# EAGLE design ULN2003_DoubleStrip_v01 (EAGLE 5.09)
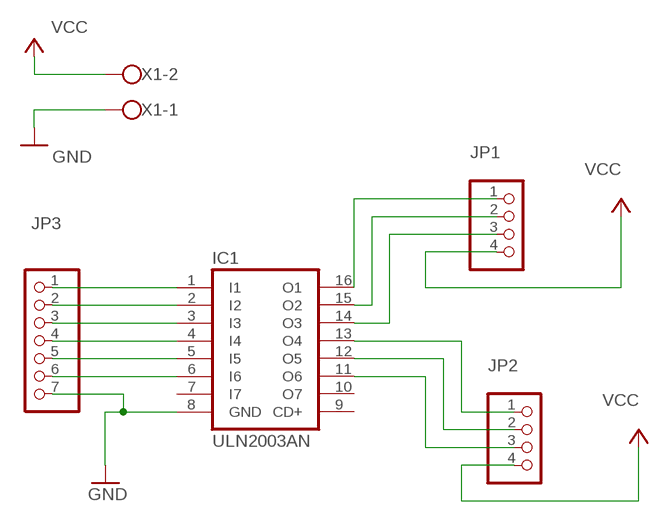
[diagram p0: schematic, sheet 1]

## Parts
IC1  ULN2003AN  [DIL16]
JP1  PINHD-1X4  [1X04]
JP2  PINHD-1X4  [1X04]
JP3  PINHD-1X7  [1X07]
X1  W237-102  [W237-102]

## Nets
GND: IC1.8(GND) JP3.7 X1.1
N$1: IC1.13(O4) JP2.1
N$2: IC1.1(I1) JP3.1
N$3: IC1.2(I2) JP3.2
N$4: IC1.3(I3) JP3.3
N$5: IC1.4(I4) JP3.4
N$6: IC1.5(I5) JP3.5
N$7: IC1.6(I6) JP3.6
N$8: IC1.16(O1) JP1.1
N$9: IC1.15(O2) JP1.2
N$10: IC1.14(O3) JP1.3
N$11: IC1.12(O5) JP2.2
N$12: IC1.11(O6) JP2.3
VCC: JP1.4 JP2.4 X1.2
Unconnected: IC1.7(I7) IC1.9(CD+) IC1.10(O7)

## Library data of the parts
IC1 = uln-udn:ULN2003A: DRIVER ARRAY
JP1 JP2 = pinhead:PINHD-1X4: PIN HEADER
JP3 = pinhead:PINHD-1X7: PIN HEADER
X1 = con-wago-500:W237-102: WAGO SCREW CLAMP

## Board
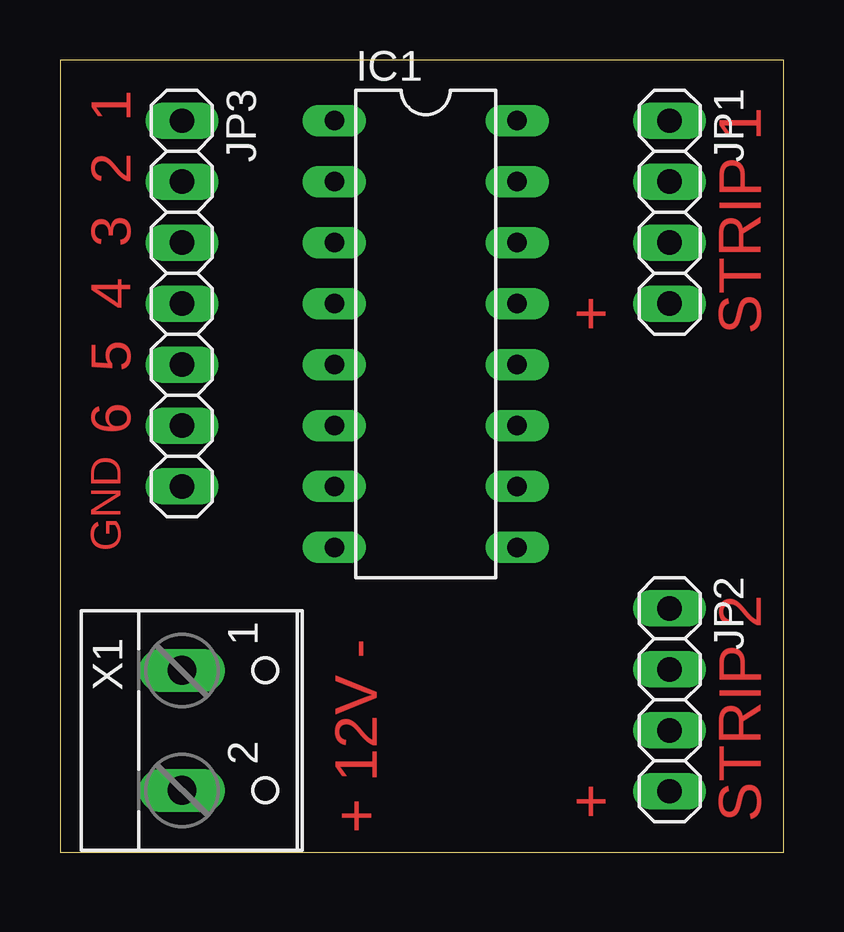
[diagram p1: board, top side]
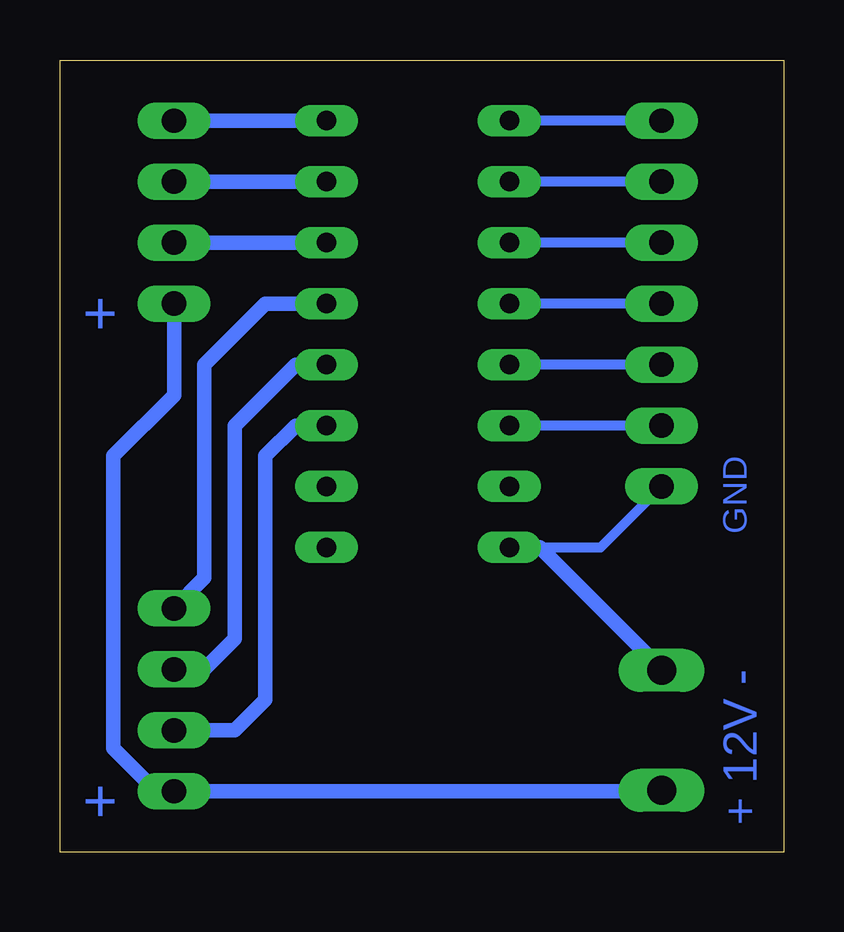
[diagram p2: board, bottom side, seen from below]

Size 30.15 x 33.01 mm. Coordinates in mm from the lower left corner, seen from the top.
Outline: 0,0 30.15,0 30.15,33.01 0,33.01 0,0
Copper layers (1*16): Top 0.035mm / dielectric 1.5mm / Bottom 0.035mm
Design rules "default": minimum track width 10mil, minimum drill 24mil, track to track 8mil, track to pad 8mil, pad to pad 8mil, via to via 8mil, smd to smd 8mil, copper to edge 40mil, drill to drill 8mil, minimum pad ring 10mil, minimum via ring 8mil, stop-mask expansion 4mil, vias tented up to drill 0mil, thermal gap 10mil

### Footprints (pad centres in the part's own frame; a part is rotated, then mirrored left to right if it is on the bottom)
DIL16 = drill 0.813 long: 1 -8.89,-3.81; 2 -6.35,-3.81; 3 -3.81,-3.81; 4 -1.27,-3.81; 5 1.27,-3.81; 6 3.81,-3.81; 7 6.35,-3.81; 8 8.89,-3.81; 9 8.89,3.81; 10 6.35,3.81; 11 3.81,3.81; 12 1.27,3.81; 13 -1.27,3.81; 14 -3.81,3.81; 15 -6.35,3.81; 16 -8.89,3.81
1X04 = drill 1.016 long: 1 -3.81,0; 2 -1.27,0; 3 1.27,0; 4 3.81,0
1X07 = drill 1.016 long: 1 -7.62,0; 2 -5.08,0; 3 -2.54,0; 4 0,0; 5 2.54,0; 6 5.08,0; 7 7.62,0
W237-102 = drill 1.194 long: 1 -2.5,-1.27; 2 2.5,-1.27

### Placement (x,y rotation side)
IC1  15.24,21.59 270 top
JP1  25.4,26.67 270 top
JP2  25.4,6.35 270 top
JP3  5.08,22.86 270 top
X1  6.35,5.08 270 top

### Tracks (layer width: path | path; a pad name or v marks a point on that pad's centre or on a via)
GND
  Bottom 0.254: X1.1 5.08,7.62 | 10.16,12.7 IC1.8
  Bottom 0.406: 10.16,12.7 7.62,12.7 JP3.7
  Bottom 0.61: 5.08,7.62 10.16,12.7
N$1
  Bottom 0.61: IC1.13 21.59,22.86 24.13,20.32 24.13,11.43 JP2.1
N$2
  Bottom 0.406: JP3.1 IC1.1
N$3
  Bottom 0.406: JP3.2 IC1.2
N$4
  Bottom 0.406: JP3.3 IC1.3
N$5
  Bottom 0.406: JP3.4 IC1.4
N$6
  Bottom 0.406: JP3.5 IC1.5
N$7
  Bottom 0.406: JP3.6 IC1.6
N$8
  Bottom 0.61: IC1.16 JP1.1
N$9
  Bottom 0.61: IC1.15 JP1.2
N$10
  Bottom 0.61: IC1.14 JP1.3
N$11
  Bottom 0.61: IC1.12 20.32,20.32 22.86,17.78 22.86,8.89 24.13,7.62 JP2.2
N$12
  Bottom 0.61: IC1.11 20.32,17.78 21.59,16.51 21.59,6.35 22.86,5.08 JP2.3
VCC
  Bottom 0.254: X1.2 5.08,2.54
  Bottom 0.61: 5.08,2.54 JP2.4 26.14,2.54 27.94,4.34 27.94,16.51 25.4,19.05 JP1.4

### Text on the board
Top: 6 5 4 3 2 1 | + | STRIP 1 | GND | + 12V - | + | STRIP 2
Bottom: + | GND | + 12V - | +